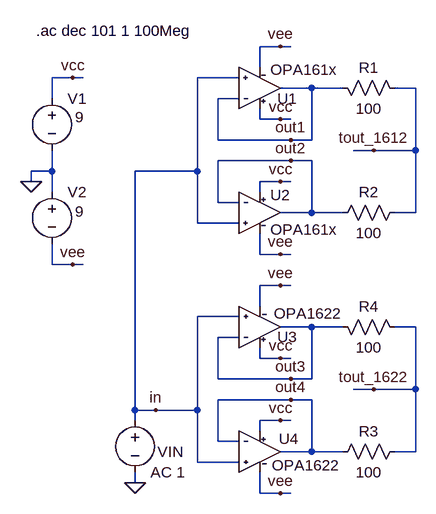
[diagram p0: schematic 02-opa1612_buffer.asc]
02-opa1612_buffer.asc, the LTspice schematic file:
Version 4
SHEET 1 880 848
WIRE -576 48 -608 48
WIRE -560 48 -576 48
WIRE -608 80 -608 48
WIRE -896 96 -928 96
WIRE -880 96 -896 96
WIRE -640 96 -704 96
WIRE -528 112 -576 112
WIRE -480 112 -528 112
WIRE -368 112 -400 112
WIRE -928 128 -928 96
WIRE -640 128 -672 128
WIRE -608 160 -608 144
WIRE -576 160 -608 160
WIRE -560 160 -576 160
WIRE -672 192 -672 128
WIRE -560 192 -672 192
WIRE -528 192 -528 112
WIRE -528 192 -560 192
WIRE -432 208 -464 208
WIRE -368 208 -368 112
WIRE -368 208 -432 208
WIRE -560 224 -672 224
WIRE -528 224 -560 224
WIRE -928 240 -928 208
WIRE -928 240 -960 240
WIRE -704 240 -704 96
WIRE -704 240 -800 240
WIRE -960 256 -960 240
WIRE -576 256 -608 256
WIRE -560 256 -576 256
WIRE -928 272 -928 240
WIRE -608 272 -608 256
WIRE -672 288 -672 224
WIRE -640 288 -672 288
WIRE -528 304 -528 224
WIRE -528 304 -576 304
WIRE -480 304 -528 304
WIRE -368 304 -368 208
WIRE -368 304 -400 304
WIRE -704 320 -704 240
WIRE -640 320 -704 320
WIRE -608 368 -608 336
WIRE -576 368 -608 368
WIRE -560 368 -576 368
WIRE -928 384 -928 352
WIRE -896 384 -928 384
WIRE -880 384 -896 384
WIRE -576 416 -608 416
WIRE -560 416 -576 416
WIRE -608 448 -608 416
WIRE -640 464 -704 464
WIRE -528 480 -576 480
WIRE -480 480 -528 480
WIRE -368 480 -400 480
WIRE -640 496 -672 496
WIRE -608 528 -608 512
WIRE -576 528 -608 528
WIRE -560 528 -576 528
WIRE -672 560 -672 496
WIRE -560 560 -672 560
WIRE -528 560 -528 480
WIRE -528 560 -560 560
WIRE -432 576 -464 576
WIRE -368 576 -368 480
WIRE -368 576 -432 576
WIRE -560 592 -672 592
WIRE -528 592 -560 592
WIRE -800 608 -800 240
WIRE -768 608 -800 608
WIRE -704 608 -704 464
WIRE -704 608 -768 608
WIRE -800 624 -800 608
WIRE -576 624 -608 624
WIRE -560 624 -576 624
WIRE -608 640 -608 624
WIRE -672 656 -672 592
WIRE -640 656 -672 656
WIRE -528 672 -528 592
WIRE -528 672 -576 672
WIRE -480 672 -528 672
WIRE -368 672 -368 576
WIRE -368 672 -400 672
WIRE -704 688 -704 608
WIRE -640 688 -704 688
WIRE -800 720 -800 704
WIRE -608 736 -608 704
WIRE -576 736 -608 736
WIRE -560 736 -576 736
FLAG -960 256 0
FLAG -896 96 vcc
FLAG -896 384 vee
FLAG -576 368 vee
FLAG -576 256 vcc
FLAG -576 48 vee
FLAG -576 160 vcc
FLAG -432 208 tout_1612
FLAG -560 192 out1
FLAG -560 224 out2
FLAG -576 736 vee
FLAG -576 624 vcc
FLAG -800 720 0
FLAG -576 416 vee
FLAG -576 528 vcc
FLAG -768 608 in
FLAG -432 576 tout_1622
FLAG -560 560 out3
FLAG -560 592 out4
SYMBOL voltage -928 112 R0
WINDOW 3 36 45 Left 2
SYMATTR Value 9
SYMATTR InstName V1
SYMBOL voltage -928 256 R0
WINDOW 3 36 46 Left 2
SYMATTR Value 9
SYMATTR InstName V2
SYMBOL res -384 288 R90
WINDOW 0 0 56 VBottom 2
WINDOW 3 32 56 VTop 2
SYMATTR InstName R2
SYMATTR Value 100
SYMBOL res -384 128 M270
WINDOW 0 32 56 VTop 2
WINDOW 3 0 56 VBottom 2
SYMATTR InstName R1
SYMATTR Value 100
SYMBOL OPA161x -512 96 M180
WINDOW 0 -53 -17 Bottom 2
SYMATTR InstName U1
SYMBOL OPA161x -512 320 R0
WINDOW 0 -64 -28 Bottom 2
WINDOW 3 -28 -6 Top 2
SYMATTR InstName U2
SYMBOL res -384 656 R90
WINDOW 0 0 56 VBottom 2
WINDOW 3 32 56 VTop 2
SYMATTR InstName R3
SYMATTR Value 100
SYMBOL voltage -800 608 R0
WINDOW 0 35 64 Left 2
SYMATTR InstName VIN
SYMATTR Value AC 1
SYMBOL res -384 496 M270
WINDOW 0 32 56 VTop 2
WINDOW 3 0 56 VBottom 2
SYMATTR InstName R4
SYMATTR Value 100
SYMBOL OPA1622 -608 672 R0
WINDOW 0 45 -4 Bottom 2
WINDOW 3 71 5 Top 2
SYMATTR InstName U4
SYMBOL OPA1622 -608 480 M180
WINDOW 0 43 0 Bottom 2
WINDOW 3 74 5 Top 2
SYMATTR InstName U3
TEXT -952 24 Left 2 !.ac dec 101 1 100Meg

The netlist it stands for:
* 02-opa1612_buffer.asc
V1 vcc 0 9
V2 0 vee 9
R2 tout_1612 out2 100
R1 tout_1612 out1 100
XU1 in out1 vcc vee out1 OPA161x  ; pins IN+ IN- VCC VEE OUT
XU2 in out2 vcc vee out2 OPA161x  ; pins IN+ IN- VCC VEE OUT
R3 tout_1622 out4 100
VIN in 0 AC 1
R4 tout_1622 out3 100
XU4 in out4 vcc vee out4 OPA1622  ; pins IN+ IN- VCC VEE OUT
XU3 in out3 vcc vee out3 OPA1622  ; pins IN+ IN- VCC VEE OUT
.ac dec 101 1 100Meg
.lib OPA161x.LIB
.lib OPA1622.LIB
.backanno
.end

* Results of the author's LTspice run, read from the files saved beside the schematic
* Operating Point, zero values left out:
*   V(vcc) = 9 V
*   V(vee) = -9 V
*   V(tout_1612) = 98.93 µV
*   V(out2) = 98.93 µV
*   V(out1) = 98.93 µV
*   V(tout_1622) = 98.25 µV
*   V(out4) = 98.25 µV
*   V(out3) = 98.25 µV
*   I(V1) = -12.4 mA
*   I(V2) = -12.4 mA
*   I(Vin) = -2.52 µA
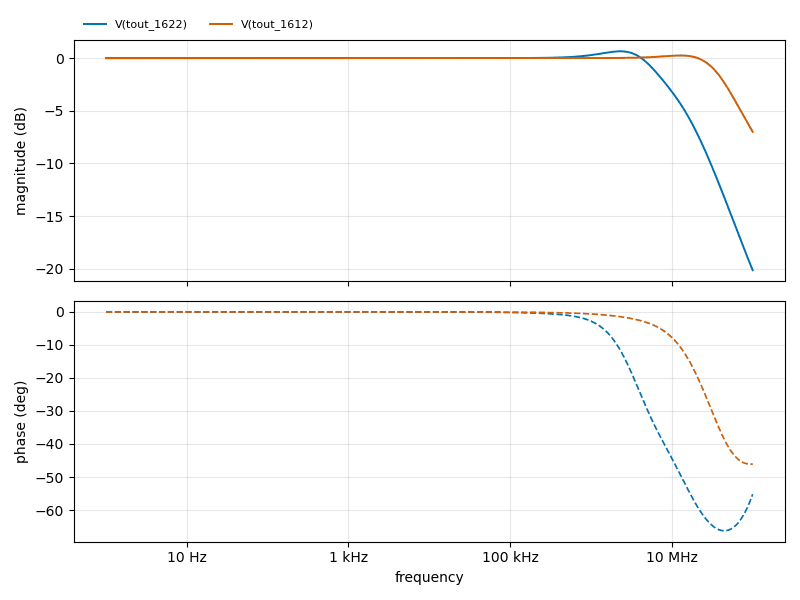
[diagram p1: AC Analysis of 02-opa1612_buffer.asc, plotted from the saved traces]
* AC Analysis, 1 run:
*   V(tout_1622): -0.00 dB at 1 Hz, -20.14 dB at 100 MHz, peak 0.65 dB at 2.325 MHz, 3 dB below the peak at 8.254 MHz
*   V(tout_1612): -0.00 dB at 1 Hz, -7.00 dB at 100 MHz, peak 0.25 dB at 12.85 MHz, 3 dB below the peak at 48.33 MHz